# Altium schematic sheet IO Expansion Header.SchDoc: Ravage - IO Expansion Header
size A4; Address1: Drawn By:; Address2: Dan Visser; DocumentNumber: A; Revision: 0.1-alpha; SheetNumber: 15; SheetTotal: 16
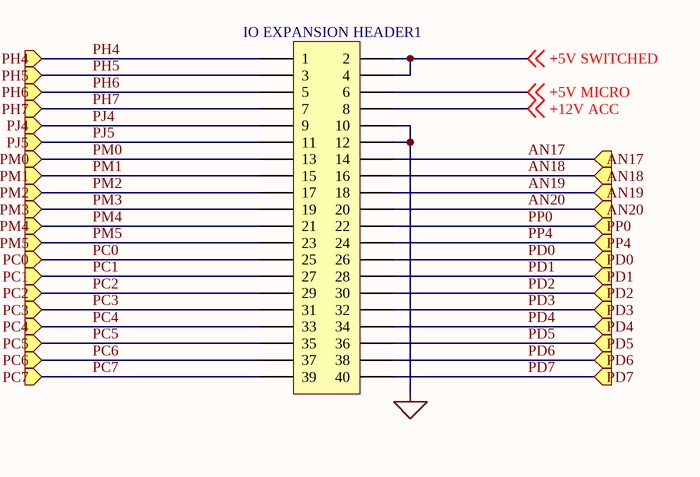
[diagram p0: IO Expansion Header.SchDoc]

## Parts
IO_EXPANSION_HEADER1  (no value)  [HDR2X20]

## Ports
AN17 (in), AN18 (in), AN19 (in), AN20 (in), PC0 (in), PC1 (in), PC2 (in), PC3 (in), PC4 (in), PC5 (in), PC6 (in), PC7 (in), PD0 (in), PD1 (in), PD2 (in), PD3 (in), PD4 (in), PD5 (in), PD6 (in), PD7 (in), PH4 (in), PH5 (in), PH6 (in), PH7 (in), PJ4 (in), PJ5 (in), PM0 (in), PM1 (in), PM2 (in), PM3 (in), PM4 (in), PM5 (in), PP0 (in), PP4 (in)

## Nets
NetIO_EXPANSION_HEADER1_10: IO_EXPANSION_HEADER1.10 IO_EXPANSION_HEADER1.12
+5V MICRO: IO_EXPANSION_HEADER1.6 ; off-sheet +5V MICRO
+5V SWITCHED: IO_EXPANSION_HEADER1.2 IO_EXPANSION_HEADER1.4 ; off-sheet +5V SWITCHED
+12V ACC: IO_EXPANSION_HEADER1.8 ; off-sheet +12V ACC
AN17: IO_EXPANSION_HEADER1.14 ; port AN17
AN18: IO_EXPANSION_HEADER1.16 ; port AN18
AN19: IO_EXPANSION_HEADER1.18 ; port AN19
AN20: IO_EXPANSION_HEADER1.20 ; port AN20
PC0: IO_EXPANSION_HEADER1.25 ; port PC0
PC1: IO_EXPANSION_HEADER1.27 ; port PC1
PC2: IO_EXPANSION_HEADER1.29 ; port PC2
PC3: IO_EXPANSION_HEADER1.31 ; port PC3
PC4: IO_EXPANSION_HEADER1.33 ; port PC4
PC5: IO_EXPANSION_HEADER1.35 ; port PC5
PC6: IO_EXPANSION_HEADER1.37 ; port PC6
PC7: IO_EXPANSION_HEADER1.39 ; port PC7
PD0: IO_EXPANSION_HEADER1.26 ; port PD0
PD1: IO_EXPANSION_HEADER1.28 ; port PD1
PD2: IO_EXPANSION_HEADER1.30 ; port PD2
PD3: IO_EXPANSION_HEADER1.32 ; port PD3
PD4: IO_EXPANSION_HEADER1.34 ; port PD4
PD5: IO_EXPANSION_HEADER1.36 ; port PD5
PD6: IO_EXPANSION_HEADER1.38 ; port PD6
PD7: IO_EXPANSION_HEADER1.40 ; port PD7
PH4: IO_EXPANSION_HEADER1.1 ; port PH4
PH5: IO_EXPANSION_HEADER1.3 ; port PH5
PH6: IO_EXPANSION_HEADER1.5 ; port PH6
PH7: IO_EXPANSION_HEADER1.7 ; port PH7
PJ4: IO_EXPANSION_HEADER1.9 ; port PJ4
PJ5: IO_EXPANSION_HEADER1.11 ; port PJ5
PM0: IO_EXPANSION_HEADER1.13 ; port PM0
PM1: IO_EXPANSION_HEADER1.15 ; port PM1
PM2: IO_EXPANSION_HEADER1.17 ; port PM2
PM3: IO_EXPANSION_HEADER1.19 ; port PM3
PM4: IO_EXPANSION_HEADER1.21 ; port PM4
PM5: IO_EXPANSION_HEADER1.23 ; port PM5
PP0: IO_EXPANSION_HEADER1.22 ; port PP0
PP4: IO_EXPANSION_HEADER1.24 ; port PP4

## Notes on the sheet
- Title
- Size:
- Date:
- A4
- Number:
- Time:
- Revision:
- Sheet
- of

## Library data of the parts
IO_EXPANSION_HEADER1 = Header 20X2: Header, 20-Pin, Dual row; LatestRevisionDate: 17-Jul-2002; LatestRevisionNote: Re-released for DXP Platform.; Publisher: Altium Limited